# Altium schematic sheet 1_TOP.SchDoc: SHMP_MainBoard - Top level
size B; Author: Sébastien Gélinas; Organization: SmartHalo; Address1: 5445 de Gaspé; Address2: Montréal, QC; Address3: Canada; Address4: H2T 3B2; DocumentNumber: 1; Revision: 1; SheetNumber: 1; SheetTotal: 4
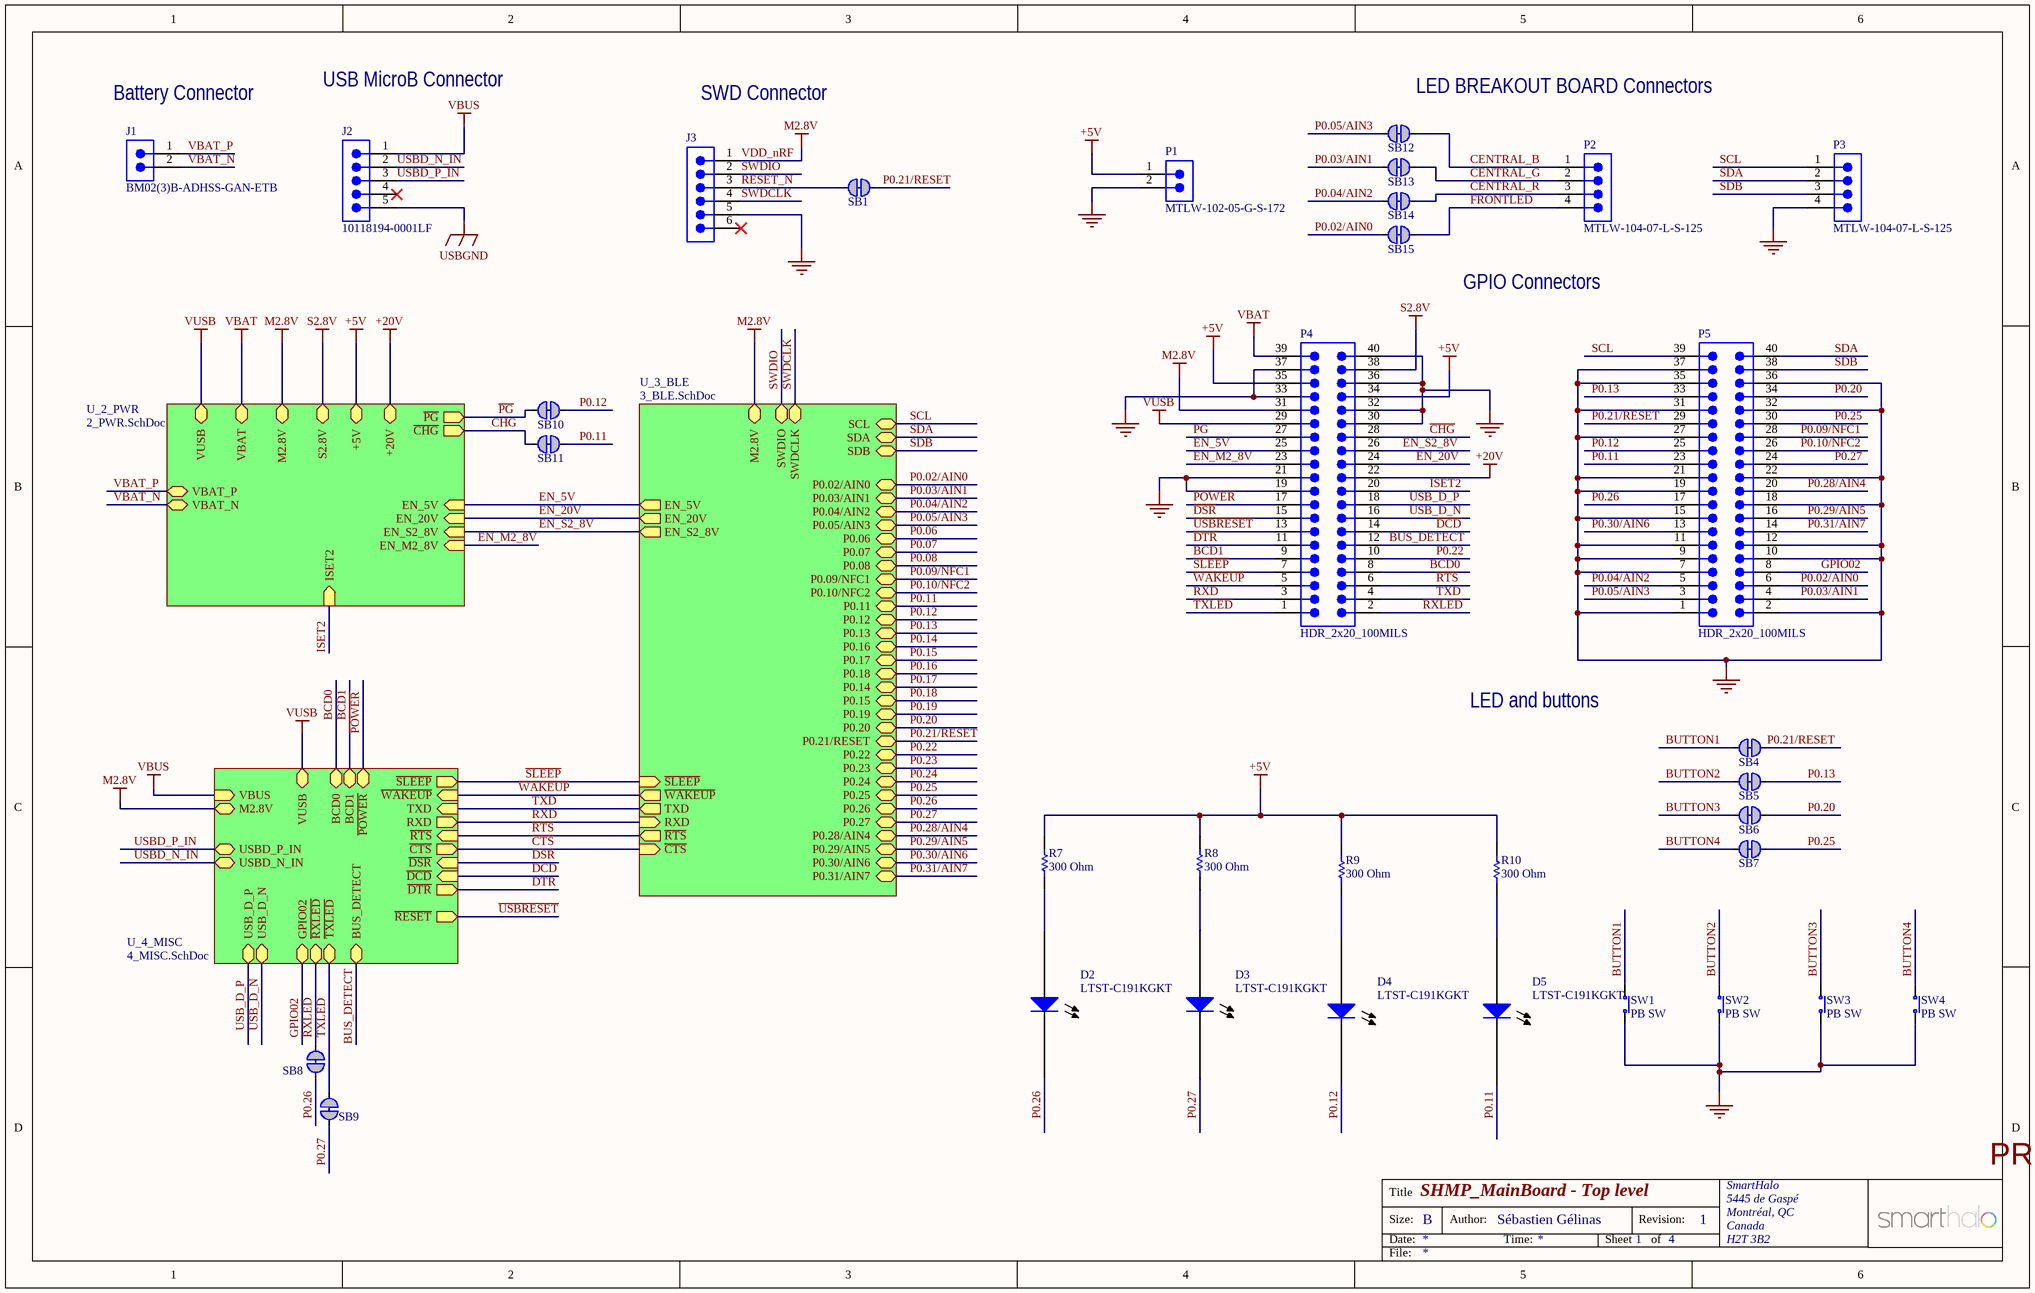
[diagram p0: 1_TOP.SchDoc]

## Parts
D2  LTST-C191KGKT  [LTST-C191KGKT]
D3  LTST-C191KGKT  [LTST-C191KGKT]
D4  LTST-C191KGKT  [LTST-C191KGKT]
D5  LTST-C191KGKT  [LTST-C191KGKT]
J1  BM02(3)B-ADHSS-GAN-ETB  [BM02(3)B-ADHSS-GAN-ETB]
J2  10118194-0001LF  [10118194-0001LF]
J3  (no value)  [JLINK_6PIN_NEEDLE_ADAPTER]  (no BOM)
P1  MTLW-102-05-G-S-172  [SMTC-MTLW-102-05-X-S-172]  (no BOM)
P2  MTLW-104-07-L-S-125  [SMTC-MTLW-104-07-X-S-125]  (no BOM)
P3  MTLW-104-07-L-S-125  [SMTC-MTLW-104-07-X-S-125]  (no BOM)
P4  HDR_2x20_100MILS  [HDR_2X20_100MILS]  (no BOM)
P5  HDR_2x20_100MILS  [HDR_2X20_100MILS]  (no BOM)
R7  300 Ohm  [Varitron_RES0603]
R8  300 Ohm  [Varitron_RES0603]
R9  300 Ohm  [Varitron_RES0603]
R10  300 Ohm  [Varitron_RES0603]
SB1  Solderbridge  [Solderbridge_Shorted]  (value not drawn)  (net tie, no BOM)
SB4  Solderbridge  [Solderbridge_Shorted]  (value not drawn)  (net tie, no BOM)
SB5  Solderbridge  [Solderbridge_Shorted]  (value not drawn)  (net tie, no BOM)
SB6  Solderbridge  [Solderbridge_Shorted]  (value not drawn)  (net tie, no BOM)
SB7  Solderbridge  [Solderbridge_Shorted]  (value not drawn)  (net tie, no BOM)
SB8  Solderbridge  [Solderbridge_Shorted]  (value not drawn)  (net tie, no BOM)
SB9  Solderbridge  [Solderbridge_Shorted]  (value not drawn)  (net tie, no BOM)
SB10  Solderbridge  [Solderbridge_Shorted]  (value not drawn)  (net tie, no BOM)
SB11  Solderbridge  [Solderbridge_Shorted]  (value not drawn)  (net tie, no BOM)
SB12  Solderbridge  [Solderbridge_Shorted]  (value not drawn)  (net tie, no BOM)
SB13  Solderbridge  [Solderbridge_Shorted]  (value not drawn)  (net tie, no BOM)
SB14  Solderbridge  [Solderbridge_Shorted]  (value not drawn)  (net tie, no BOM)
SB15  Solderbridge  [Solderbridge_Shorted]  (value not drawn)  (net tie, no BOM)
SW1  PB SW  [ALPS_SKHUxxx010_WO_GND]
SW2  PB SW  [ALPS_SKHUxxx010_WO_GND]
SW3  PB SW  [ALPS_SKHUxxx010_WO_GND]
SW4  PB SW  [ALPS_SKHUxxx010_WO_GND]

## Sub-sheets
U_2_PWR = 2_PWR.SchDoc: ISET2 (in), ~{PG} (out), ~{CHG} (out), EN_S2_8V (in), EN_M2_8V (in), EN_20V (in), EN_5V (in), +20V, +5V, S2.8V, M2.8V, VUSB, VBAT_N, VBAT_P, VBAT
U_3_BLE = 3_BLE.SchDoc: SDA (bidir), SDB (bidir), SCL (bidir), ~{WAKEUP} (out), ~{SLEEP} (in), RXD (in), TXD (out), P0.02/AIN0, P0.03/AIN1, P0.04/AIN2, P0.05/AIN3, P0.06, P0.07, P0.08, P0.09/NFC1, P0.10/NFC2, P0.11, P0.12, P0.13, P0.16, P0.17, P0.18, P0.14, P0.15, P0.19, P0.20, P0.21/RESET, P0.22, P0.23, P0.24, P0.25, P0.26, P0.27, P0.28/AIN4, P0.29/AIN5, P0.30/AIN6, P0.31/AIN7, SWDIO (bidir), SWDCLK (bidir), EN_S2_8V (out), EN_5V (out), EN_20V (out), ~{CTS} (in), ~{RTS} (out), M2.8V
U_4_MISC = 4_MISC.SchDoc: TXD (in), RXD (out), ~{CTS} (out), ~{RTS} (in), ~{WAKEUP} (in), ~{RESET} (out), ~{DSR} (in), ~{DCD} (in), ~{DTR} (out), BCD0, BUS_DETECT, GPIO02, ~{POWER}, ~{TXLED}, BCD1, ~{RXLED}, VBUS (in), USBD_P_IN (bidir), USBD_N_IN (bidir), USB_D_N (bidir), USB_D_P (bidir), ~{SLEEP} (out), M2.8V, VUSB

## Nets
+5V: P1.1 P4.34 P4.35 R7.2 R8.2 R9.2 R10.2 ; sheet U_2_PWR/+5V
+20V: P4.22 ; sheet U_2_PWR/+20V
GND: J1.0(ASSY) J3.5 P1.2 P3.4 P4.19 P4.21 P4.30 P4.32 P4.33 P4.36 P4.37 P4.40 P5.1 P5.2 P5.7 P5.9 P5.10 P5.11 P5.12 P5.15 P5.18 P5.19 P5.21 P5.22 P5.27 P5.31 P5.32 P5.35 P5.36 P5.37 SW1.1(N.O) SW2.1(N.O) SW3.1(N.O) SW4.1(N.O)
S2.8V: P4.38 ; sheet U_2_PWR/S2.8V
USBGND: J2.0(ASSY) J2.5
VBAT: P4.39 ; sheet U_2_PWR/VBAT
VBUS: J2.1 ; sheet U_4_MISC/VBUS
VDD_nRF: J3.1 P4.31 ; sheet U_3_BLE/M2.8V, sheet U_2_PWR/M2.8V, sheet U_4_MISC/M2.8V  [also labelled M2.8V]
VUSB: P4.29 ; sheet U_2_PWR/VUSB, sheet U_4_MISC/VUSB
BCD0: P4.8 ; sheet U_4_MISC/BCD0
BCD1: P4.9 ; sheet U_4_MISC/BCD1
BUS_DETECT: P4.12 ; sheet U_4_MISC/BUS_DETECT
BUTTON1: SB4.2 SW1.2(COM)
BUTTON2: SB5.2 SW2.2(COM)
BUTTON3: SB6.2 SW3.2(COM)
BUTTON4: SB7.2 SW4.2(COM)
~{CHG}: P4.28 SB11.1 ; sheet U_2_PWR/~{CHG}
~{CTS}: sheet U_3_BLE/~{CTS}, sheet U_4_MISC/~{CTS}
CENTRAL_B: P2.1 SB12.1
CENTRAL_G: P2.2 SB13.1
CENTRAL_R: P2.3 SB14.1
~{DCD}: P4.14 ; sheet U_4_MISC/~{DCD}
~{DSR}: P4.15 ; sheet U_4_MISC/~{DSR}
~{DTR}: P4.11 ; sheet U_4_MISC/~{DTR}
EN_5V: P4.25 ; sheet U_3_BLE/EN_5V, sheet U_2_PWR/EN_5V
EN_20V: P4.24 ; sheet U_3_BLE/EN_20V, sheet U_2_PWR/EN_20V
EN_M2_8V: P4.23 ; sheet U_2_PWR/EN_M2_8V
EN_S2_8V: P4.26 ; sheet U_3_BLE/EN_S2_8V, sheet U_2_PWR/EN_S2_8V
FRONTLED: P2.4 SB15.1
GPIO02: P5.8 ; sheet U_4_MISC/GPIO02
ISET2: P4.20 ; sheet U_2_PWR/ISET2
P0.02/AIN0: P5.6 SB15.2 ; sheet U_3_BLE/P0.02/AIN0
P0.03/AIN1: P5.4 SB13.2 ; sheet U_3_BLE/P0.03/AIN1
P0.04/AIN2: P5.5 SB14.2 ; sheet U_3_BLE/P0.04/AIN2
P0.05/AIN3: P5.3 SB12.2 ; sheet U_3_BLE/P0.05/AIN3
P0.06: sheet U_3_BLE/P0.06
P0.07: sheet U_3_BLE/P0.07
P0.08: sheet U_3_BLE/P0.08
P0.09/NFC1: P5.28 ; sheet U_3_BLE/P0.09/NFC1
P0.10/NFC2: P5.26 ; sheet U_3_BLE/P0.10/NFC2
P0.11: D5.2(Cathode) P5.23 SB11.2 ; sheet U_3_BLE/P0.11
P0.12: D4.2(Cathode) P5.25 SB10.2 ; sheet U_3_BLE/P0.12
P0.13: P5.33 SB5.1 ; sheet U_3_BLE/P0.13
P0.14: sheet U_3_BLE/P0.16
P0.15: sheet U_3_BLE/P0.17
P0.16: sheet U_3_BLE/P0.18
P0.17: sheet U_3_BLE/P0.14
P0.18: sheet U_3_BLE/P0.15
P0.19: sheet U_3_BLE/P0.19
P0.20: P5.34 SB6.1 ; sheet U_3_BLE/P0.20
P0.21/RESET: P5.29 SB1.1 SB4.1 ; sheet U_3_BLE/P0.21/RESET
P0.22: P4.10 ; sheet U_3_BLE/P0.22
P0.23: sheet U_3_BLE/P0.23
P0.24: sheet U_3_BLE/P0.24
P0.25: P5.30 SB7.1 ; sheet U_3_BLE/P0.25
P0.26: D2.2(Cathode) P5.17 SB8.2 ; sheet U_3_BLE/P0.26
P0.27: D3.2(Cathode) P5.24 SB9.2 ; sheet U_3_BLE/P0.27
P0.28/AIN4: P5.20 ; sheet U_3_BLE/P0.28/AIN4
P0.29/AIN5: P5.16 ; sheet U_3_BLE/P0.29/AIN5
P0.30/AIN6: P5.13 ; sheet U_3_BLE/P0.30/AIN6
P0.31/AIN7: P5.14 ; sheet U_3_BLE/P0.31/AIN7
~{PG}: P4.27 SB10.1 ; sheet U_2_PWR/~{PG}
~{POWER}: P4.17 ; sheet U_4_MISC/~{POWER}
~{RTS}: P4.6 ; sheet U_3_BLE/~{RTS}, sheet U_4_MISC/~{RTS}
~{RXLED}: P4.2 SB8.1 ; sheet U_4_MISC/~{RXLED}
RESET_N: J3.3 SB1.2
RXD: P4.3 ; sheet U_3_BLE/RXD, sheet U_4_MISC/RXD
~{SLEEP}: P4.7 ; sheet U_3_BLE/~{SLEEP}, sheet U_4_MISC/~{SLEEP}
SCL: P3.1 P5.39 ; sheet U_3_BLE/SCL
SDA: P3.2 P5.40 ; sheet U_3_BLE/SDA
SDB: P3.3 P5.38 ; sheet U_3_BLE/SDB
SWDCLK: J3.4 ; sheet U_3_BLE/SWDCLK
SWDIO: J3.2 ; sheet U_3_BLE/SWDIO
~{TXLED}: P4.1 SB9.1 ; sheet U_4_MISC/~{TXLED}
TXD: P4.4 ; sheet U_3_BLE/TXD, sheet U_4_MISC/TXD
~{USBRESET}: P4.13 ; sheet U_4_MISC/~{RESET}
USB_D_N: P4.16 ; sheet U_4_MISC/USB_D_N
USB_D_P: P4.18 ; sheet U_4_MISC/USB_D_P
USBD_N_IN: J2.2 ; sheet U_4_MISC/USBD_N_IN
USBD_P_IN: J2.3 ; sheet U_4_MISC/USBD_P_IN
VBAT_N: J1.2 ; sheet U_2_PWR/VBAT_N
VBAT_P: J1.1 ; sheet U_2_PWR/VBAT_P
~{WAKEUP}: P4.5 ; sheet U_3_BLE/~{WAKEUP}, sheet U_4_MISC/~{WAKEUP}
NetD2_1: D2.1(Anode) R7.1
NetD3_1: D3.1(Anode) R8.1
NetD4_1: D4.1(Anode) R9.1
NetD5_1: D5.1(Anode) R10.1

Not connected (* = marked no-connect by the designer): J2 4*; J3 6*

## Notes on the sheet
- (near J1) Battery Connector
- USB MicroB Connector
- SWD Connector
- (near SB12) LED BREAKOUT BOARD Connectors
- GPIO Connectors
- LED and buttons
- PRELIMINARY: DO NOT USE FOR PRODUCTION
- Title
- Size:
- Date:
- B
- Author:
- Time:
- Sheet
- Revision:
- of
- File:

## Library data of the parts
D2-D5 = LTST-C191KGKT: SMT LED, Green 571nm, Discrete 2V 0603 (1608 Metric); Manufacturer: LiteOn; Manufacturer Part Number: LTST-C191KGKT; Part Number: LTST-C191KGKT; Supplier: Digikey; Footprint Name: 0603; Supplier Part Number: 160-1446-6-ND
J1 = BM02(3)B-ADHSS-GAN-ETB: Connector, 1.3 mm pitch; Manufacturer: JST; Manufacturer Part Number: BM02(3)B-ADHSS-GAN-ETB; Part Number: BM02(3)B-ADHSS-GAN-ETB; Supplier: Arrow Electronics; Footprint Name: CUSTOM(ADH Connector 2 pins)
J2 = 10118194-0001LF: Micro USB B Type Receptacle; Manufacturer: Amphenol FCI; Manufacturer Part Number: 10118194-0001LF; Part Number: 10118194-0001LF; Supplier: Arrow Electronics; Footprint Name: CUSTOM(Micro USB connector); Supplier Part Number: *
J3 = JLINK_6PIN_NEEDLE_ADAPTER: JLink 6 Pin Needle Adapter for Flasher ARM Programmer; Manufacturer: JLink; Supplier: Digikey
P1 = SMTC-MTLW-102-05-X-S-172: Low Profile .025" SQ Post Header, Through-hole, Vertical, -55 to 125 degC, 2.54 mm Pitch, 2-Pin, Male, RoHS; Manufacturer: Samtec; Pitch: 2.54 mm; ComponentLink2URL: http://www.samtec.com/documents/webfiles/pdf/MTLW_TH.PDF; PackageDescription: Low Profile Terminal Assembly; ComponentLink3URL: http://www.samtec.com/documents/webfiles/cpdf/MTLW-1XX-XX-XX-X-XXX-XX-XX-MKT1.pdf; PackageReference: MTLW-102-05-X-S-172; Mounting Technology: Through-hole; ComponentLink2Description: Datasheet; PackageVersion: T, 6/1991; Orientation: Vertical; DatasheetVersion: F-214; RoHS: True; ComponentLink3Description: Package Specification; ComponentLink1URL: http://www.samtec.com; Temperature Range: -55 to 125 degC; PartNumber: MTLW-102-05-G-S-172; ComponentLink1Description: Manufacturer URL
P2 P3 = SMTC-MTLW-104-07-X-S-125: Low Profile .025" SQ Post Header, Through-hole, Vertical, -55 to 125 degC, 2.54 mm Pitch, 4-Pin, Male, RoHS; Manufacturer: Samtec; Pitch: 2.54 mm; PackageDescription: Low Profile Terminal Assembly; PartNumber: MTLW-104-07-L-S-125; PackageReference: MTLW-104-07-X-S-125; ComponentLink1Description: Manufacturer URL; ComponentLink2Description: Datasheet; ComponentLink2URL: http://www.samtec.com/documents/webfiles/pdf/MTLW_TH.PDF; ComponentLink3Description: Package Specification; Mounting Technology: Through-hole; ComponentLink3URL: http://www.samtec.com/documents/webfiles/cpdf/MTLW-1XX-XX-XX-X-XXX-XX-XX-MKT1.pdf; ComponentLink1URL: http://www.samtec.com; Orientation: Vertical; PackageVersion: T, 6/1991; DatasheetVersion: F-214; Temperature Range: -55 to 125 degC; RoHS: True
P4 P5 = HDR_2x20_100MILS: Header, 100 mils, 2 rows, 40 pins
R7-R10 = Varitron_RES0603: 300 0.063W 5%  0603 (1608 Metric)  SMD; Case-Metric: 1608; Case-EIA: 0603; Tolerance: 5%; Technology: SMT; Power: 0.063W; Supplier: Arrow Electronics; Footprint Name: 0603; Value: 300 Ohm
SB1 SB4-SB15 = SOLDERBRIDGE_SHORTED: Shorted Solderbridge; Value: Solderbridge
SW1-SW4 = SW-PB: ALPS - SKHUALE010 - Tactile Switch, SPNO, SMD, 6.5x6.2x2.5mm; Part Number: ALPS_SKHUALE010; 2nd source part number: 688-SKHUALE010; Artikkelnr Noca: 50019001; Artikkelnr Simpro: N.A.; Manufacturer: Alps; Manufacturer Part Number: SKHUALE010; Datasheet: https://www1.elfa.se/data1/wwwroot/webroot/Z_DATA/03579000.pdf; LatestRevisionDate: 2010-02-01; Pin Count: 4; Publisher: Nordic Semiconductor; Published: 2010-02-01; Value: PB SW; Note: *; Supplier: Elfa; Supplier part number: 35-790-00; 2nd source Supplier: Mouser; Footprint Doc: ALPS_SKHUxxx010_WO_GND